# EAGLE design usb-relais (EAGLE 5.03)
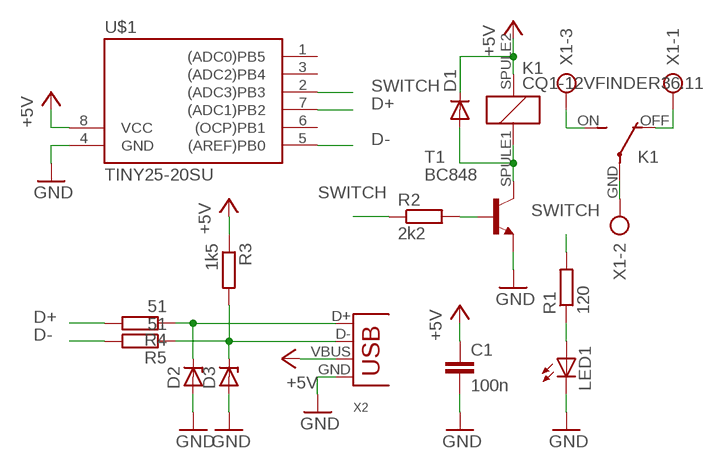
[diagram p0: schematic, sheet 1]

## Parts
C1  100n  C-EUC1206  [C1206]
D1  DIODE-MINIMELF  [MINIMELF]
D2  ZENER-DIODE  [MINIMELF]
D3  ZENER-DIODE  [MINIMELF]
K1  CQ1-12VFINDER36.11  [FINDER-36.11]
LED1  LEDCHIPLED_1206  [CHIPLED_1206]
R1  120  R-EU_R1206  [R1206]
R2  2k2  R-EU_R1206  [R1206]
R3  1k5  R-EU_R1206  [R1206]
R4  51  R-EU_R1206  [R1206]
R5  51  R-EU_R1206  [R1206]
T1  BC848  [SOT23]
U$1  TINY25-20SU  [SOIC8]
X1  AK500/3  [AK500/3]
X2  USB-A-S  [USB-A-S]

## Nets
+5V: C1.1 D1.C K1.SPULE2 R3.1 U$1.8(VCC) X2.VBUS
D+: R4.2 U$1.7((ADC1)PB2)
D-: R5.2 U$1.5((AREF)PB0)
GND: C1.2 D2.A D3.A LED1.C T1.2(E) U$1.4(GND) X2.GND
N$1: D1.A K1.SPULE1 T1.3(C)
N$2: K1.OFF(2:O) X1.1
N$3: K1.GND(2:P) X1.2
N$4: K1.ON(2:S) X1.3
N$5: LED1.A R1.1
N$6: R2.2 T1.1(B)
N$7: D3.C R3.2 R5.1 X2.D-
N$8: D2.C R4.1 X2.D+
SWITCH: R1.2 R2.1 U$1.2((ADC3)PB3)
Unconnected: U$1.1((ADC0)PB5) U$1.3((ADC2)PB4) U$1.6((OCP)PB1)

## Library data of the parts
C1 = rcl:C-EU: CAPACITOR, European symbol
D1 = diode:DIODE-: DIODE
D2 D3 = diode:ZENER-DIODE: Z-Diode
K1 = relay:CQ1-12V: AUTOMOTIVE QUIET RELAY NAiS Source: http://www.mew-europe.com/.. en_ds_61208_0000.pdf
LED1 = led:LED: LED OSRAM: - CHIPLED LG R971, LG N971, LY N971, LG Q971, LY Q971, LO R971, LY R971 LH N974, LH R974 LS Q976, LO Q976, LY Q976 LO Q996 - Hyper CHIPLED LW Q18S LB Q993, LB Q99A, LB R99A - SideLED LS A670, LO A670, LY A670, LG A670, LP A670 LB A673, LV A673, LT A673, LW A673 LH A674 LY A675 LS A676, LA A676, LO A676, LY A676, LW A676 LS A679, LY A679, LG A679 - Hyper Micro SIDELED® LS Y876, LA Y876, LO Y876, LY Y876 LT Y87S - SmartLED LW L88C, LW L88S LB L89C, LB L89S, LG L890 LS L89K, LO L89K, LY L89K LS L896, LA L896, LO L896, LY L896 - TOPLED LS T670, LO T670, LY T670, LG T670, LP T670 LSG T670, LSP T670, LSY T670, LOP T670, LYG T670 LG T671, LOG T671, LSG T671 LB T673, LV T673, LT T673, LW T673 LH T674 LS T676, LA T676, LO T676, LY T676, LB T676, LH T676, LSB T676, LW T676 LB T67C, LV T67C, LT T67C, LS T67K, LO T67K, LY T67K, LW E67C LS E67B, LA E67B, LO E67B, LY E67B, LB E67C, LV E67C, LT E67C LW T67C LS T679, LY T679, LG T679 LS T770, LO T770, LY T770, LG T770, LP T770 LB T773, LV T773, LT T773, LW T773 LH T774 LS E675, LA E675, LY E675, LS T675 LS T776, LA T776, LO T776, LY T776, LB T776 LHGB T686 LT T68C, LB T68C - Hyper Mini TOPLED® LB M676 - Mini TOPLED Santana® LG M470 LS M47K, LO M47K, LY M47K Source: http://www.osram.convergy.de - LUMILED® LXK2-PW12-R00, LXK2-PW12-S00, LXK2-PW14-U00, LXK2-PW14-V00 LXK2-PM12-R00, LXK2-PM12-S00, LXK2-PM14-U00 LXK2-PE12-Q00, LXK2-PE12-R00, LXK2-PE12-S00, LXK2-PE14-T00, LXK2-PE14-U00 LXK2-PB12-K00, LXK2-PB12-L00, LXK2-PB12-M00, LXK2-PB14-N00, LXK2-PB14-P00, LXK2-PB14-Q00 LXK2-PR12-L00, LXK2-PR12-M00, LXK2-PR14-Q00, LXK2-PR14-R00 LXK2-PD12-Q00, LXK2-PD12-R00, LXK2-PD12-S00 LXK2-PH12-R00, LXK2-PH12-S00 LXK2-PL12-P00, LXK2-PL12-Q00, LXK2-PL12-R00 Source: www.luxeon.com
R1-R5 = rcl:R-EU_: RESISTOR, European symbol
T1 = transistor:BC848: NPN TRANSISTOR
U$1 = avr-4:TINY25
X1 = con-ptr500:AK500/3: CONNECTOR
X2 = con-usb-3:USB: USB Connectors

## Board
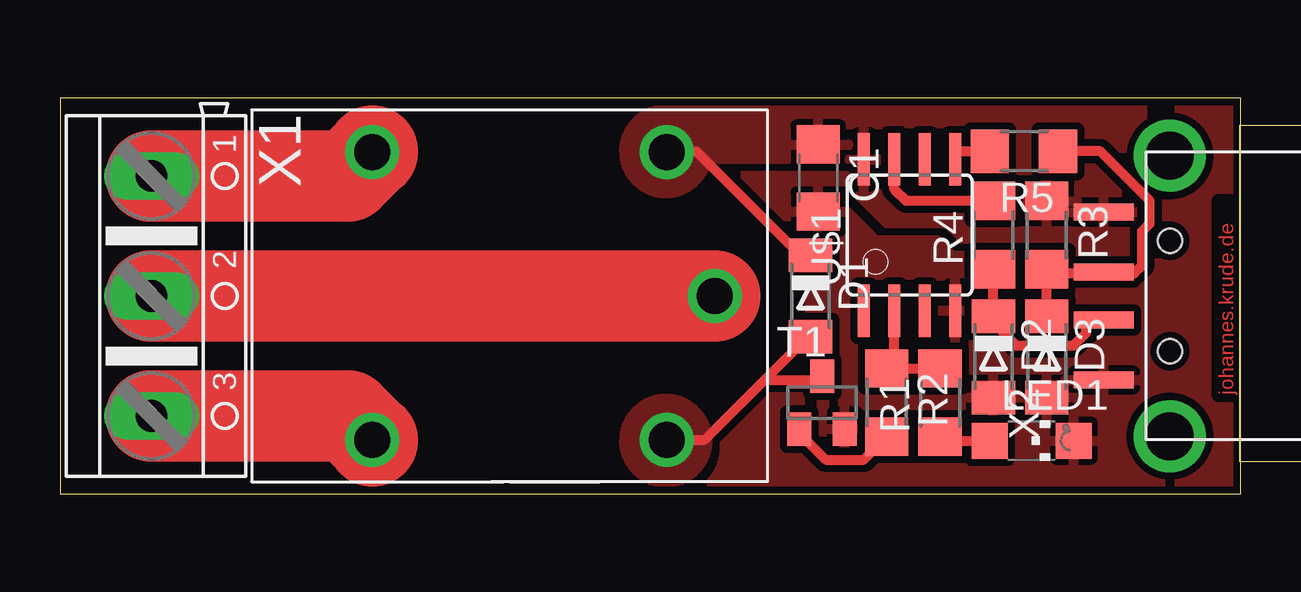
[diagram p1: board, top side]

Size 49.2 x 16.5 mm. Coordinates in mm from the lower left corner, seen from the top.
Outline: 49.2,16.5 0,16.5 0,0 49.2,0 49.2,16.5
Copper layers (1*16): Top 0.035mm / dielectric 1.5mm / Bottom 0.035mm
Design rules "default *": minimum track width 10mil, minimum drill 24mil, track to track 12mil, track to pad 12mil, pad to pad 8mil, via to via 8mil, smd to smd 8mil, copper to edge 12mil, drill to drill 8mil, minimum pad ring 10mil, minimum via ring 8mil, stop-mask expansion 4mil, vias tented up to drill 0mil, thermal gap 10mil

### Footprints (pad centres in the part's own frame; a part is rotated, then mirrored left to right if it is on the bottom)
C1206 = smd 1.6 x 1.8: 1 -1.4,0; 2 1.4,0
MINIMELF = smd 1.4 x 1.8: A 1.7,0; C -1.7,0
FINDER-36.11 = drill 1.5 round: GND -8.55,0; OFF 5.72,-6; ON 5.72,6; SPULE1 -6.55,6; SPULE2 -6.55,-6
CHIPLED_1206 = smd 1.5 x 1.5: A 0,-1.75; C 0,1.75
R1206 = smd 1.6 x 1.803: 1 -1.422,0; 2 1.422,0
SOT23 = smd 1 x 1.4: 1 -0.95,-1.1; 2 0.95,-1.1; 3 0,1.1
SOIC8 = smd 0.5 x 2.2: 1 -1.905,-3.154; 2 -0.645,-3.154; 3 0.625,-3.154; 4 1.895,-3.154; 5 1.905,3.154; 6 0.635,3.154; 7 -0.635,3.154; 8 -1.905,3.154
AK500/3 = drill 1.321 long: 1 -5.004,0; 2 0,0; 3 5.004,0
USB-A-S = smd 2.5 x 0.7: D+ 1.75,1; D- 1.75,-1; GND 1.75,3.5; VBUS 1.75,-3.5 | drill 2 round: P$5 -1,-5.85; P$6 -1,5.85 | hole 1: -1,2.3; -1,-2.3

### Placement (x,y rotation side)
C1  31.58,13.17 270 top
D1  31.27,8.25 270 top
D2  38.89,5.71 270 top
D3  41.11,5.71 270 top
K1  18.73,8.25 180 top
LED1  40.47,2.22 270 top
R1  36.66,3.8 90 top
R2  34.44,3.8 270 top
R3  41.11,10.79 270 top
R4  38.89,10.79 90 top
R5  40.16,14.28 180 top
T1  31.74,3.81 0 top
U$1  35.39,10.79 0 top
X1  3.8,8.25 270 top
X2  45.24,8.25 180 top

### Tracks (layer width: path | path; a pad name or v marks a point on that pad's centre or on a via)
+5V
  Top 0.406: K1.SPULE2 25.31,14.28 26.5,14.28 30.79,10 | 30.79,10 30.79,10.31 | 31.27,10 D1.C | 30.79,10 31.27,10 | 31.27,10
  pour Top (no thermals): 25.23,12.54 arc90 26.98,14.28 26.98,14.28 arc90 25.23,16.03 25.23,16.03 arc90 23.49,14.28 arc90
  pour Top: 25.39,16.51 45.08,16.51 45.08,9.52 38.73,9.52 36.98,11.27 34.44,11.27 33.33,12.38 33.33,13.96 25.39,13.96
D+
  Top 0.406: 34.76,13.96 U$1.7 34.76,12.69 35.24,12.22 38.57,12.22 38.58,12.21 R4.2
D-
  Top 0.406: U$1.5 37.3,14.28 R5.2
GND
  pour Top (rank 2): 49.21,16.19 49.21,0.31 19.68,0.31 arc-90 17.77,2.06 arc-90 19.68,3.81 26.98,3.81 arc90 31.27,8.25 arc90 27.3,12.69 19.68,12.69 arc-90 17.77,14.44 arc-90 19.36,16.19
N$1
  Top 0.406: K1.SPULE1 26.85,2.25 | T1.3 | T1.3 31.58,4.76 29.36,4.76 | D1.A 31.27,6.66 29.36,4.76 | 26.85,2.25 | 26.85,2.25 29.36,4.76 | T1.3 31.73,4.77 31.74,4.76 29.36,4.76
  pour Top (no thermals): 25.23,0.47 arc90 26.98,2.22 26.98,2.22 arc90 25.23,3.96 25.23,3.96 arc90 23.49,2.22 arc90
N$2
  Top 3.81: 13.01,14.28 | 13.01,14.28 K1.OFF | X1.1 11.98,13.25 13.01,14.28
N$3
  Top 3.81: X1.2 K1.GND
N$4
  Top 3.81: 13.01,2.22 | 13.01,2.22 K1.ON | X1.3 11.98,3.25 13.01,2.22
N$5
  Top 0.406: R1.1 36.66,2.22 LED1.A
N$6
  Top 0.406: T1.1 30.95,2.71 30.95,2.38 31.9,1.42 33.49,1.42 R2.2 34.44,2.54 R2.2
N$7
  Top 0.406: 41.11,7.3 D3.C R3.2 | 40.96,9.2 40.95,9.52 | R3.2 40.96,9.2 | R3.2 | 40.96,9.2 43.05,9.2 X2.D- 43.49,9.21 43.49,9.2 44.76,9.2 45.08,9.52 45.08,10.95 45.4,11.27 45.4,12.22 43.33,14.28 R5.1
N$8
  Top 0.406: R4.1 D2.C 38.89,7.14 39.05,7.14 39.05,6.98 39.84,6.19 42.22,6.19 42.74,6.71 42.74,7.25 X2.D+
SWITCH
  Top 0.406: 34.76,5.39 34.59,5.23 R2.1 | U$1.2 34.75,5.4 34.76,5.39 | 34.76,5.39 34.76,5.23 R1.2

### Text on the board
Top: johannes.krude.de